# EAGLE design 555-PWM-Motor-Speed-Controller (EAGLE 7.2.0)
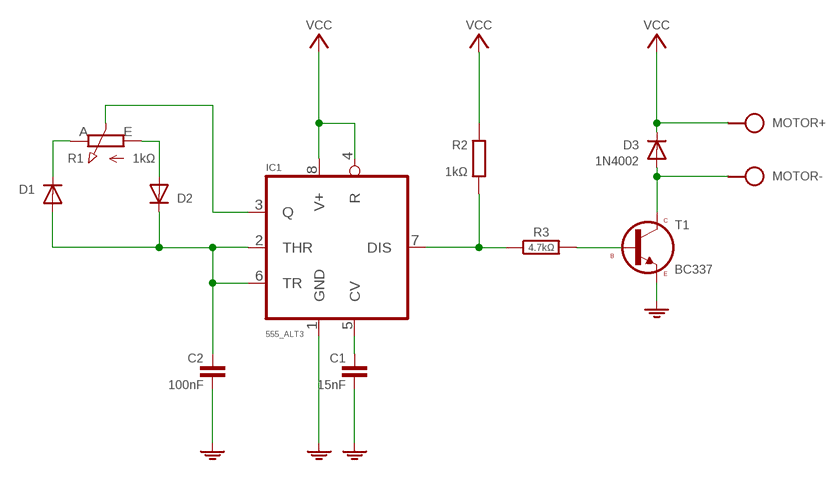
[diagram p0: schematic, sheet 1]

## Parts
C1  15nF  C050-020X044/V  [C050-020X044/V]
C2  100nF  C075-020X044  [C075-020X044]
D1  DIODE34-7V  [DO34-7V]
D2  DIODE34-7V  [DO34-7V]
D3  1N4002  DIODE35-7  [DO35-7]
IC1  555_ALT3  [DIL08]
MOTOR  SPAD+-+-  [SPAD+-]
R1  1kΩ  POT-H-3P  [CONN-3P]
R2  1kΩ  R0204/10  [0204/10]
R3  4.7kΩ  R-H0204/10  [0204/10]
S1  VCC_GNDL  [SPAD-+]
T1  BC337  BC337CBE-A  [TO92-CBE-A]

## Nets
GND: C1.2 C2.2 IC1.1(GND) S1.1 T1.3(E)
N$1: C1.1 IC1.5(CV)
N$2: IC1.7(DIS) R2.2 R3.1
N$3: IC1.3(Q) R1.2(S)
N$4: D1.C R1.3(E)
N$5: D2.A R1.1(A)
N$6: C2.1 D1.A D2.C IC1.2(THR) IC1.6(TR)
N$7: R3.2 T1.2(B)
N$8: D3.A MOTOR.1 T1.1(C)
VCC: D3.C IC1.4(R) IC1.8(V+) MOTOR.2 R2.1 S1.2

## Library data of the parts
C1 C2 = c:C: CAPACITOR, European symbol
D1-D3 = d:DIODE
IC1 = ic:*555_ALT3
MOTOR = pad:SPAD+-
R1 = r:POT-H
R2 = r:R: RESISTOR, European symbol
R3 = r:R-H
S1 = pad:VCC_GND
T1 = t:BC337

## Board
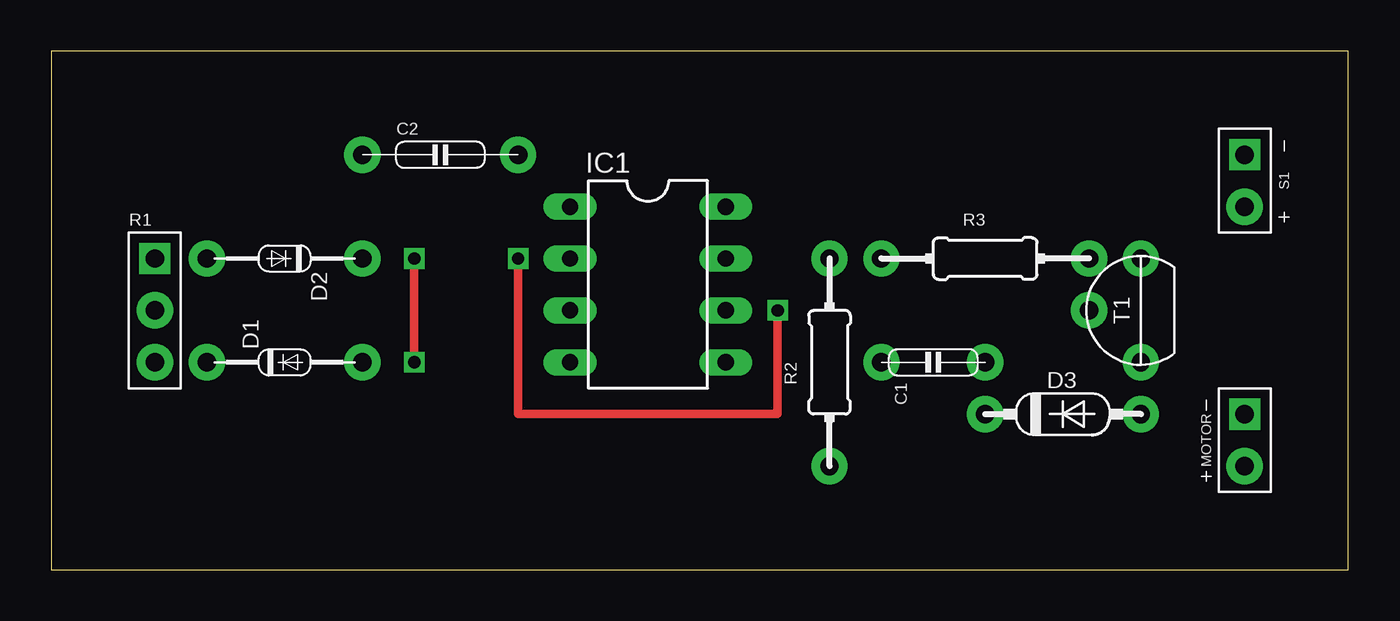
[diagram p1: board, top side]
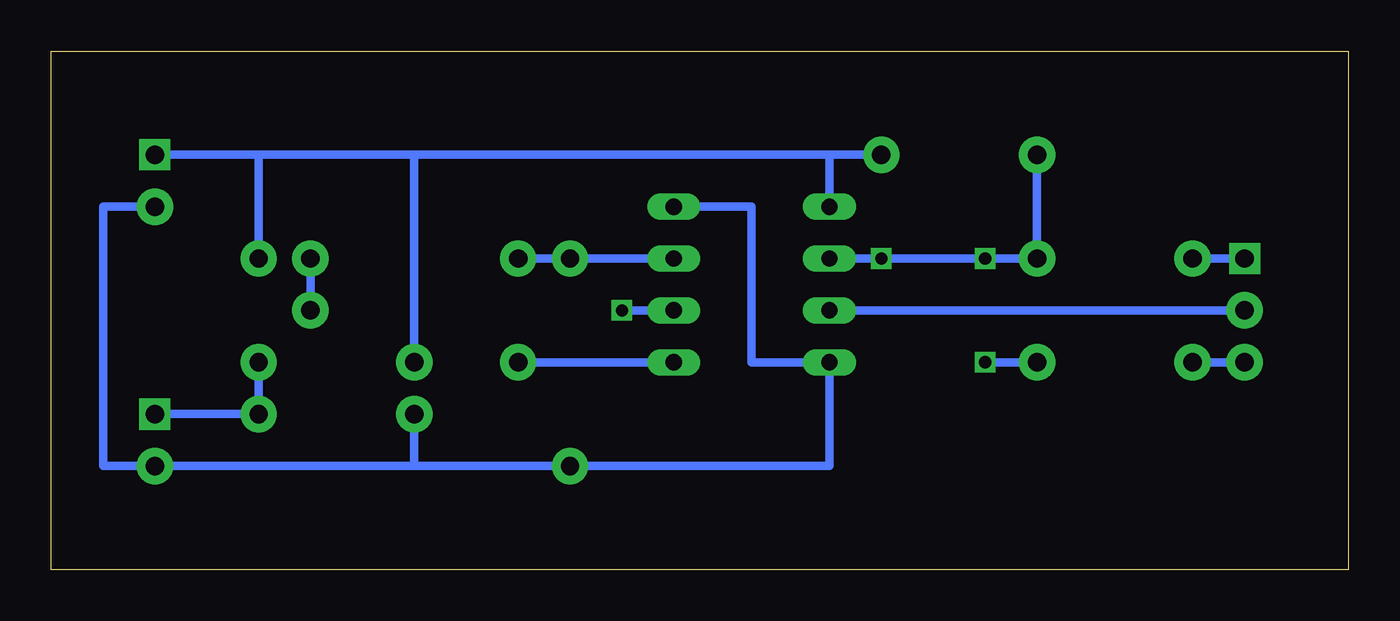
[diagram p2: board, bottom side, seen from below]

Size 63.5 x 25.4 mm. Coordinates in mm from the lower left corner, seen from the top.
Outline: 0,0 63.5,0 63.5,25.4 0,25.4 0,0
Copper layers (1*16): Top 0.035mm / dielectric 1.5mm / Bottom 0.035mm
Design rules "default": minimum track width 10mil, minimum drill 24mil, track to track 8mil, track to pad 8mil, pad to pad 8mil, via to via 8mil, smd to smd 8mil, copper to edge 40mil, drill to drill 8mil, minimum pad ring 10mil, minimum via ring 8mil, stop-mask expansion 4mil, vias tented up to drill 0mil, thermal gap 10mil

### Footprints (pad centres in the part's own frame; a part is rotated, then mirrored left to right if it is on the bottom)
C050-020X044/V = drill 0.9 pad 1.778: 1 0,2.54; 2 0,-2.54
C075-020X044 = drill 0.9 pad 1.778: 1 -2.54,0; 2 5.08,0
DO34-7V = drill 0.9 pad 1.778: A 0,-3.81; C 0,3.81
DO35-7 = drill 0.9 pad 1.778: A 3.81,0; C -3.81,0
DIL08 = drill 0.8 pad 1.27 long: 1 -3.81,3.81; 2 -3.81,1.27; 3 -3.81,-1.27; 4 -3.81,-3.81; 5 3.81,-3.81; 6 3.81,-1.27; 7 3.81,1.27; 8 3.81,3.81
SPAD+- = drill 0.9 pad 1.524 square: 1 0,-1.27 | drill 0.9 pad 1.778: 2 0,1.27
CONN-3P = drill 0.9 pad 1.524 square: 1 0,2.54 | drill 0.9 pad 1.778: 2 0,0; 3 0,-2.54
0204/10 = drill 0.9 pad 1.778: 1 -5.08,0; 2 5.08,0
SPAD-+ = drill 0.9 pad 1.524 square: 1 0,-1.27 | drill 0.9 pad 1.778: 2 0,1.27
TO92-CBE-A = drill 0.9 pad 1.778: 1 0,2.54; 2 2.54,0; 3 0,-2.54

### Placement (x,y rotation side)
C1  43.18,10.16 90 top
C2  17.78,20.32 0 top
D1  11.43,10.16 90 top
D2  11.43,15.24 270 top
D3  49.53,7.62 0 top
IC1  29.21,13.97 0 top
MOTOR  58.42,6.35 180 top
R1  5.08,12.7 0 top
R2  38.1,10.16 90 top
R3  45.72,15.24 0 top
S1  58.42,19.05 180 top
T1  53.34,12.7 180 top

### Tracks (layer width: path | path; a pad name or v marks a point on that pad's centre or on a via)
GND
  Bottom 0.406: T1.3 53.34,20.32 | 53.34,20.32 45.72,20.32 | 45.72,20.32 25.4,20.32 | 25.4,20.32 IC1.1 | C1.2 45.72,20.32 | C2.2 25.4,20.32 | S1.1 53.34,20.32
N$1
  Bottom 0.406: C1.1 IC1.5
N$2
  Bottom 0.406: R3.1 R2.2 IC1.7
N$3
  Bottom 0.406: IC1.3 R1.2
N$4
  Bottom 0.406: R1.3 D1.C
N$5
  Bottom 0.406: D2.A R1.1
N$6  (via drill 0.6)
  Top 0.406: v35.56,12.7 35.56,7.62 22.86,7.62 v22.86,15.24 | v17.78,10.16 v17.78,15.24
  Bottom 0.406: IC1.6 v35.56,12.7 | IC1.2 v22.86,15.24 v17.78,15.24 D2.C C2.1 | D1.A v17.78,10.16
N$7
  Bottom 0.406: T1.2 R3.2
N$8
  Bottom 0.406: T1.1 D3.A MOTOR.1
VCC
  Bottom 0.406: 45.72,5.08 R2.1 25.4,5.08 IC1.4 29.21,10.16 29.21,17.78 IC1.8 | 45.72,5.08 MOTOR.2 60.96,5.08 60.96,17.78 S1.2 | D3.C 45.72,5.08